# EAGLE design dwm_mk1 (EAGLE 6.5.0)
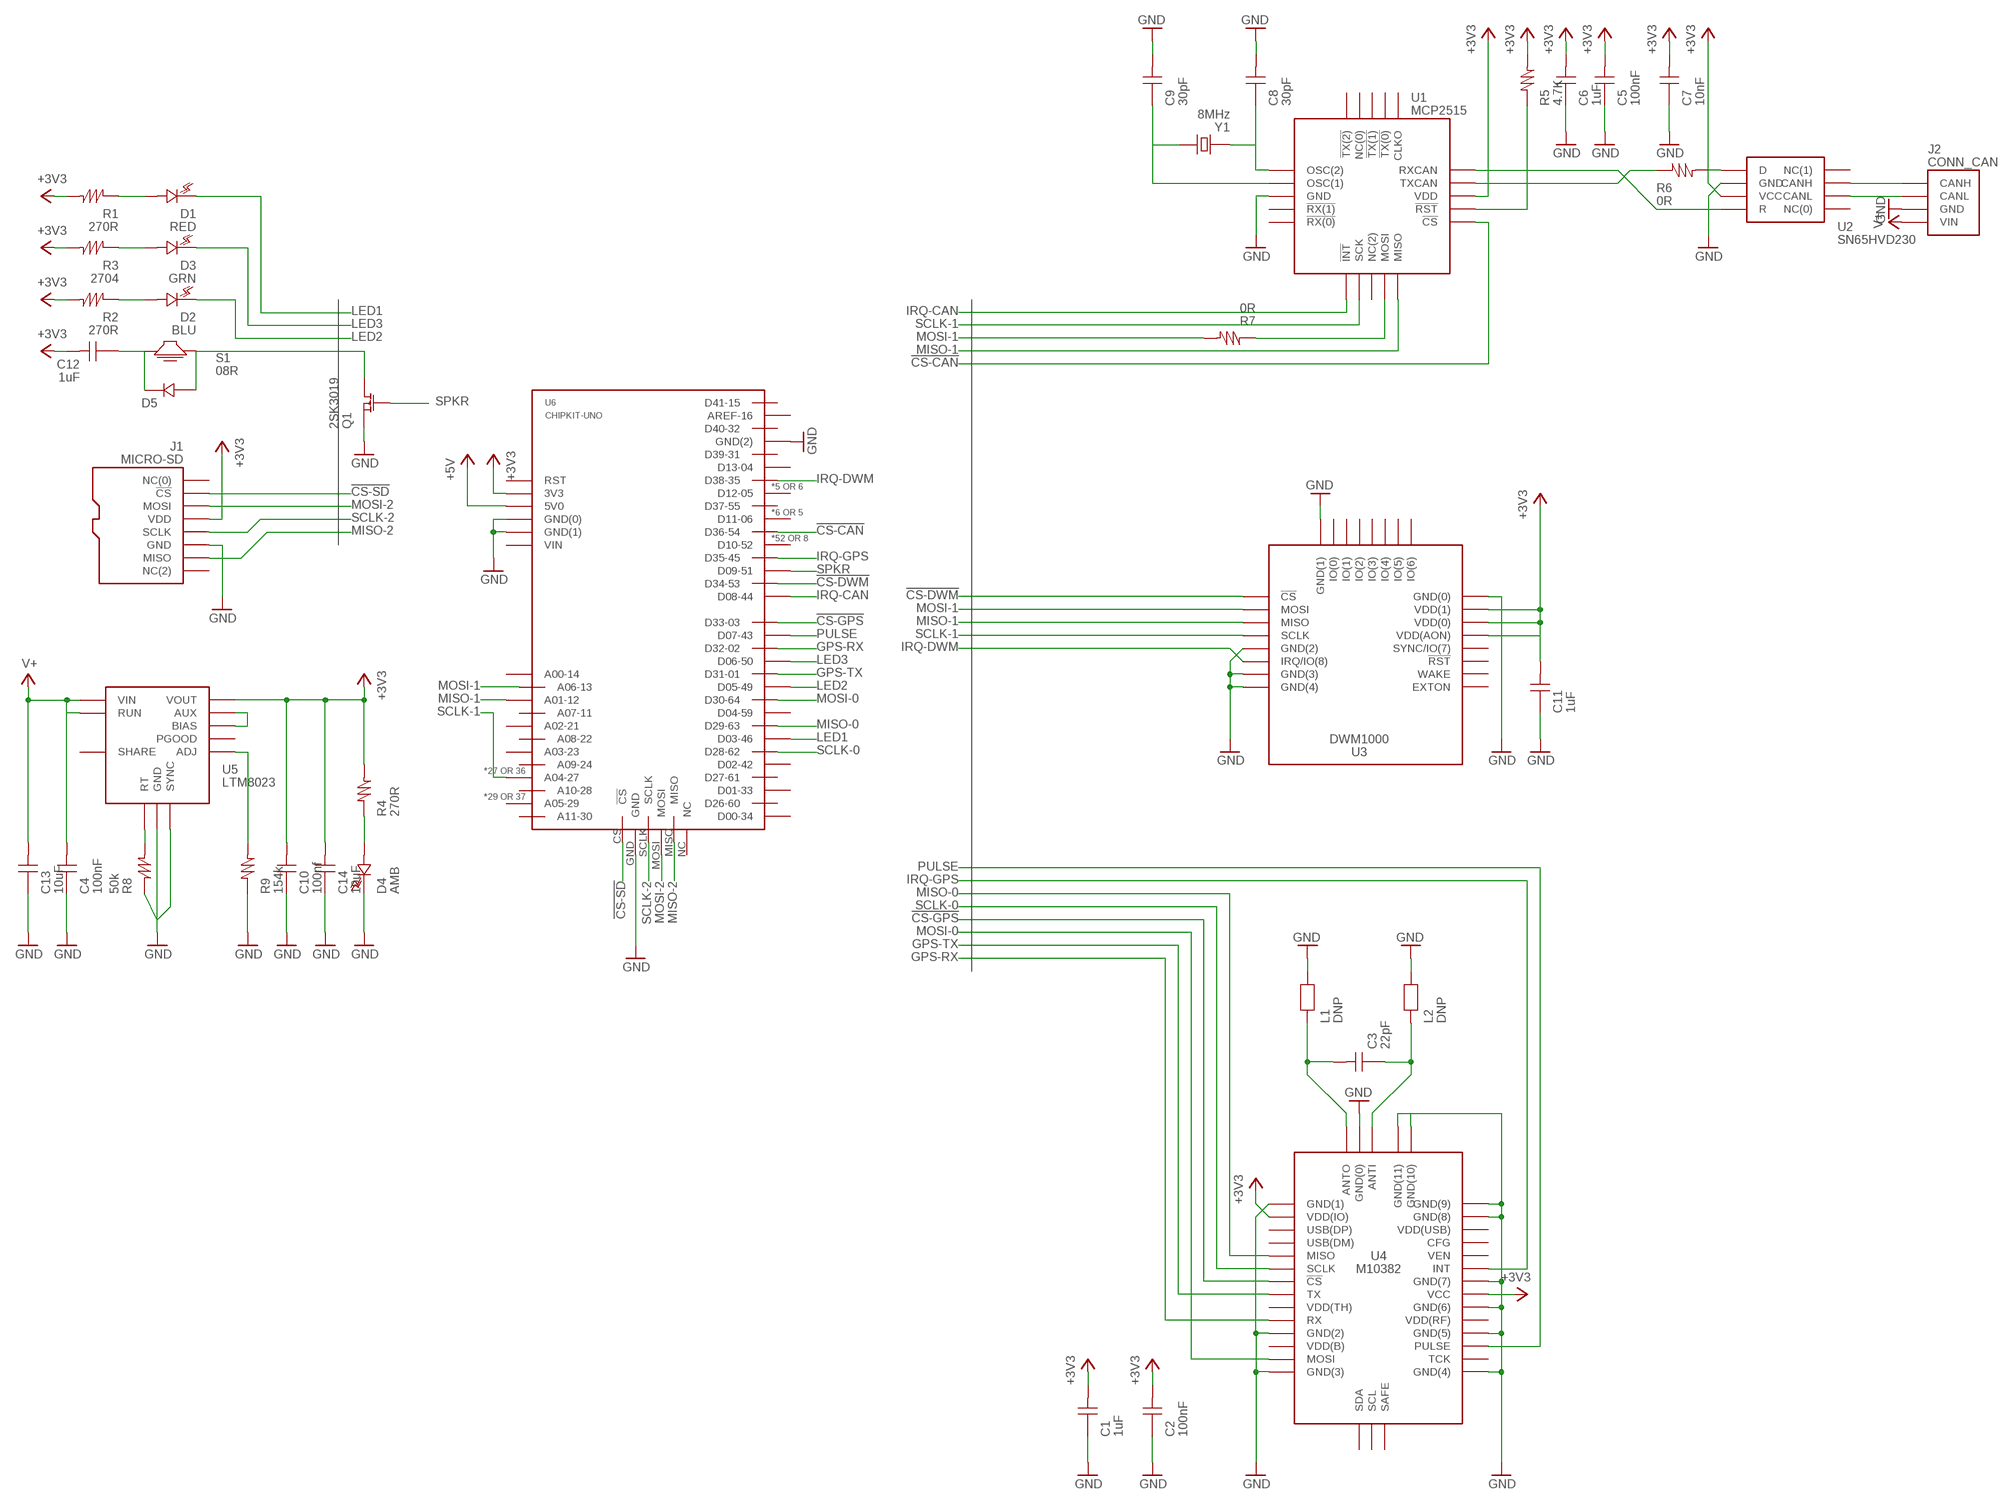
[diagram p0: schematic, sheet 1]

## Parts
C1  1uF  CAPACITOR0603  [E_0603@1]
C2  100nF  CAPACITOR0603  [E_0603@1]
C3  22pF  CAPACITOR0603  [E_0603@1]
C4  100nF  CAPACITOR0603  [E_0603@1]
C5  100nF  CAPACITOR0603  [E_0603@1]
C6  1uF  CAPACITOR0603  [E_0603@1]
C7  10nF  CAPACITOR0603  [E_0603@1]
C8  30pF  CAPACITOR0603  [E_0603@1]
C9  30pF  CAPACITOR0603  [E_0603@1]
C10  100nf  CAPACITOR0603  [E_0603@1]
C11  1uF  CAPACITOR0603  [E_0603@1]
C12  1uF  CAPACITOR0603  [E_0603@1]
C13  10uF  CAPACITOR1206  [E_1206@1]
C14  10uF  CAPACITOR1206  [E_1206@1]
D1  RED  LED0603  [E_0603@1]
D2  BLU  LED0603  [E_0603@1]
D3  GRN  LED0603  [E_0603@1]
D4  AMB  LED0603  [E_0603@1]
D5  DIODE  DIODE0603  [E_0603@1]
J1  MICRO-SD  CONN_SDMICRO  [SMT_MICROSD]
J2  CONN_CAN  [CON_4PIN]
L1  DNP  INDUCTOR0603  [E_0603@1]
L2  DNP  INDUCTOR0603  [E_0603@1]
Q1  2SK3019  [E_SOT416]
R1  270R  RESISTOR0603  [E_0603@1]
R2  270R  RESISTOR0603  [E_0603@1]
R3  2704  RESISTOR0603  [E_0603@1]
R4  270R  RESISTOR0603  [E_0603@1]
R5  4.7K  RESISTOR0603  [E_0603@1]
R6  0R  RESISTOR0603  [E_0603@1]
R7  0R  RESISTOR0603  [E_0603@1]
R8  50k  RESISTOR0603  [E_0603@1]
R9  154k  RESISTOR0603  [E_0603@1]
S1  08R  SPEAKERSMT  [SMT_BUZZER]
U1  MCP2515  MCP2515QFN20  [E_QFN20]
U2  SN65HVD230  [E_SOIC8]
U3  DWM1000  [DEC_DWM1000]
U4  M10382  [ANT_M10382]
U5  LTM8023  [LTM_8023]
U6  CHIPKIT-UNO  CHIPKITUNO  [MCP_CHIPKITUNO]
Y1  8MHz  CTS406  [CTS_CRYSTAL]

## Nets
!CS-CAN: U1.P$16(!CS) U6.D36(D36-54)
!CS-DWM: U3.P$17(!CS) U6.D34(D34-53)
!CS-GPS: U4.P$10(!CS) U6.D33(D33-03)
!CS-SD: J1.P$2(!CS) U6.CS(!CS)
+3V3: C1.P$1 C2.P$1 C5.P$1 C6.P$1 C7.P$1 C10.P$1 C11.P$1 C12.P$1 C14.P$1 J1.P$4(VDD) R1.P$1 R2.P$1 R3.P$1 R4.P$1 R5.P$1 U1.P$18(VDD) U2.P$3(VCC) U3.P$5(VDD(AON)) U3.P$6(VDD(0)) U3.P$7(VDD(1)) U4.P$5(VDD(IO)) U4.P$27(VCC) U5.A1(VOUT) U5.A2(VOUT) U5.A3(VOUT) U5.A4(VOUT) U5.B1(VOUT) U5.B2(VOUT) U5.B3(VOUT) U5.B4(VOUT) U5.C1(VOUT) U5.C2(VOUT) U5.C3(VOUT) U5.C4(VOUT) U6.3V3
+5V: U6.5V0
GND: C1.P$2 C2.P$2 C4.P$2 C5.P$2 C6.P$2 C7.P$2 C8.P$1 C9.P$1 C10.P$2 C11.P$2 C13.P$2 C14.P$2 D4.P$2 J1.P$6(GND) J2.P$3(GND) L1.P$1 L2.P$1 Q1.P$1(SOURCE) R8.P$2 R9.P$2 U1.P$8(GND) U2.P$2(GND) U3.P$8(GND(0)) U3.P$16(GND(1)) U3.P$21(GND(2)) U3.P$23(GND(3)) U3.P$24(GND(4)) U4.P$2(GND(0)) U4.P$4(GND(1)) U4.P$14(GND(2)) U4.P$17(GND(3)) U4.P$21(GND(4)) U4.P$24(GND(5)) U4.P$26(GND(6)) U4.P$28(GND(7)) U4.P$33(GND(8)) U4.P$34(GND(9)) U4.P$35(GND(10)) U4.P$36(GND(11)) U5.A5(GND) U5.A6(GND) U5.A7(GND) U5.B5(GND) U5.B6(GND) U5.B7(GND) U5.C5(GND) U5.C6(GND) U5.C7(GND) U5.D1(GND) U5.D2(GND) U5.D3(GND) U5.D4(GND) U5.D5(GND) U5.D6(GND) U5.D7(GND) U5.E1(GND) U5.E2(GND) U5.E3(GND) U5.E4(GND) U5.E5(GND) U5.E6(GND) U5.E7(GND) U5.F6(GND) U5.G6(SYNC) U6.GND U6.GND(0) U6.GND(1) U6.GND(2)
GPS-RX: U4.P$13(RX) U6.D32(D32-02)
GPS-TX: U4.P$11(TX) U6.D31(D31-01)
IRQ-CAN: U1.P$11(!INT) U6.D08(D08-44)
IRQ-DWM: U3.P$22(IRQ/IO(8)) U6.D38(D38-35)
IRQ-GPS: U4.P$29(INT) U6.D35(D35-45)
LED1: D1.P$2 U6.D03(D03-46)
LED2: D2.P$2 U6.D05(D05-49)
LED3: D3.P$2 U6.D06(D06-50)
MISO-0: U4.P$8(MISO) U6.D29(D29-63)
MISO-1: U1.P$15(MISO) U3.P$19(MISO) U6.A01(A01-12)
MISO-2: J1.P$7(MISO) U6.MISO
MOSI-0: U4.P$16(MOSI) U6.D30(D30-64)
MOSI-1: R7.P$1 U3.P$18(MOSI) U6.A06(A06-13)
MOSI-2: J1.P$3(MOSI) U6.MOSI
N$1: C3.P$1 L1.P$2 U4.P$3(ANTO)
N$2: C3.P$2 L2.P$2 U4.P$1(ANTI)
N$3: D1.P$1 R1.P$2
N$4: D3.P$1 R3.P$2
N$5: R5.P$2 U1.P$17(!RST)
N$8: C12.P$2 D5.P$2 S1.P$1
N$9: R6.P$1 U2.P$1(D)
N$10: R8.P$1 U5.G7(RT)
N$11: R6.P$2 U1.P$19(TXCAN)
N$12: U1.P$20(RXCAN) U2.P$4(R)
N$13: R7.P$2 U1.P$14(MOSI)
N$14: C8.P$2 U1.P$6(OSC(2)) Y1.P$3
N$15: C9.P$2 U1.P$7(OSC(1)) Y1.P$1
N$16: R9.P$1 U5.H7(ADJ)
N$17: U5.F5(AUX) U5.G5(BIAS)
N$18: D5.P$1 Q1.P$3(DRAIN) S1.P$4
N$19: D4.P$1 R4.P$2
N$20: J2.P$1(CANH) U2.P$7(CANH)
N$21: J2.P$2(CANL) U2.P$6(CANL)
PULSE: U4.P$23(PULSE) U6.D07(D07-43)
R2: D2.P$1 R2.P$2
SCLK-0: U4.P$9(SCLK) U6.D28(D28-62)
SCLK-1: U1.P$12(SCK) U3.P$20(SCLK) U6.A04(A04-27)
SCLK-2: J1.P$5(SCLK) U6.SCLK
SPKR: Q1.P$2(GATE) U6.D09(D09-51)
V+: C4.P$1 C13.P$1 J2.P$4(VIN) U5.G1(VIN) U5.G2(VIN) U5.G3(VIN) U5.H1(VIN) U5.H2(VIN) U5.H3(VIN) U5.H5(RUN)
Unconnected: J1.P$1(NC(0)) J1.P$8(NC(2)) U1.P$1(CLKO) U1.P$2(!TX(0)) U1.P$3(!TX(1)) U1.P$4(NC(0)) U1.P$5(!TX(2)) U1.P$9(!RX(1)) U1.P$10(!RX(0)) U1.P$13(NC(2)) U2.P$5(NC(1)) U2.P$8(NC(0)) U3.P$1(EXTON) U3.P$2(WAKE) U3.P$3(!RST) U3.P$4(SYNC/IO(7)) U3.P$9(IO(6)) U3.P$10(IO(5)) U3.P$11(IO(4)) U3.P$12(IO(3)) U3.P$13(IO(2)) U3.P$14(IO(1)) U3.P$15(IO(0)) U4.P$6(USB(DP)) U4.P$7(USB(DM)) U4.P$12(VDD(TH)) U4.P$15(VDD(B)) U4.P$18(SDA) U4.P$19(SCL) U4.P$20(SAFE) U4.P$22(TCK) U4.P$25(VDD(RF)) U4.P$30(VEN) U4.P$31(CFG) U4.P$32(VDD(USB)) U5.F7(SHARE) U5.H6(PGOOD) U6.A00(A00-14) U6.A02(A02-21) U6.A03(A03-23) U6.A05(A05-29) U6.A07(A07-11) U6.A08(A08-22) U6.A09(A09-24) U6.A10(A10-28) U6.A11(A11-30) U6.AREF(AREF-16) U6.D00(D00-34) U6.D01(D01-33) U6.D02(D02-42) U6.D04(D04-59) U6.D10(D10-52) U6.D11(D11-06) U6.D12(D12-05) U6.D13(D13-04) U6.D26(D26-60) U6.D27(D27-61) U6.D37(D37-55) U6.D39(D39-31) U6.D40(D40-32) U6.D41(D41-15) U6.NC U6.RST U6.VIN

## Library data of the parts
C1-C14 = evan:CAPACITOR
D1-D4 = evan:LED
D5 = evan:DIODE
J1 = evan:CONN_SD
J2 = evan:CONN_CAN
L1 L2 = evan:INDUCTOR
Q1 = evan:2SK3019
R1-R9 = evan:RESISTOR
S1 = evan:SPEAKER
U1 = evan:MCP2515
U2 = evan:SN65HVD230
U3 = evan:DWM1000
U4 = evan:M10382
U5 = evan:LTM8023
U6 = evan:CHIPKITUNO
Y1 = evan:CTS406

## Board
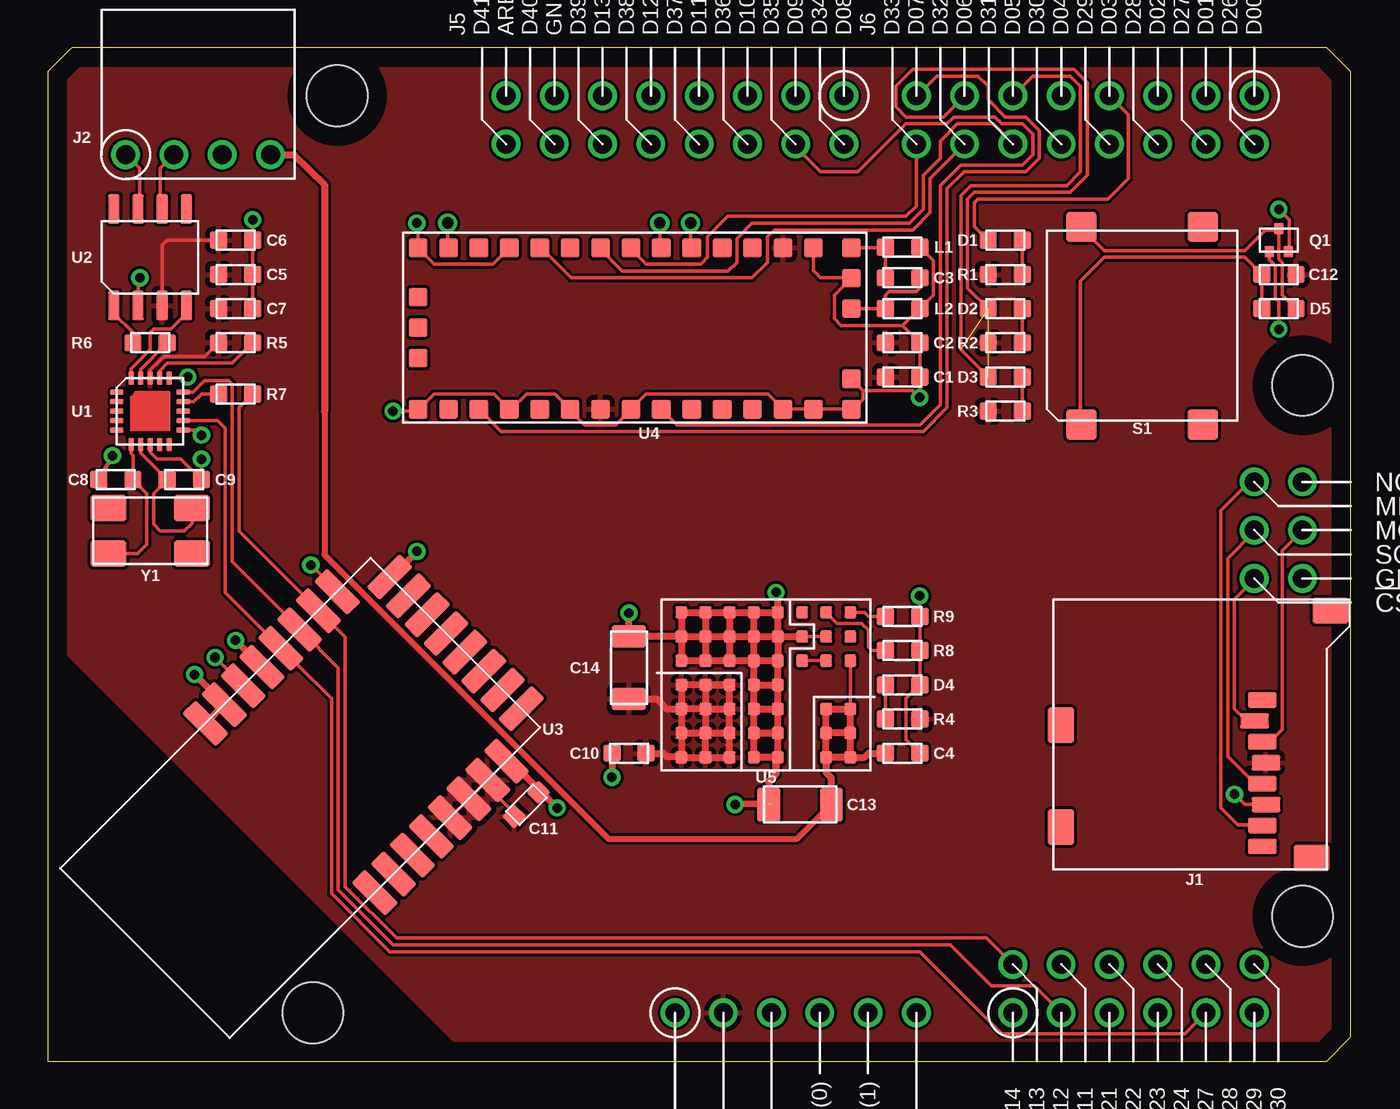
[diagram p1: board, top side]
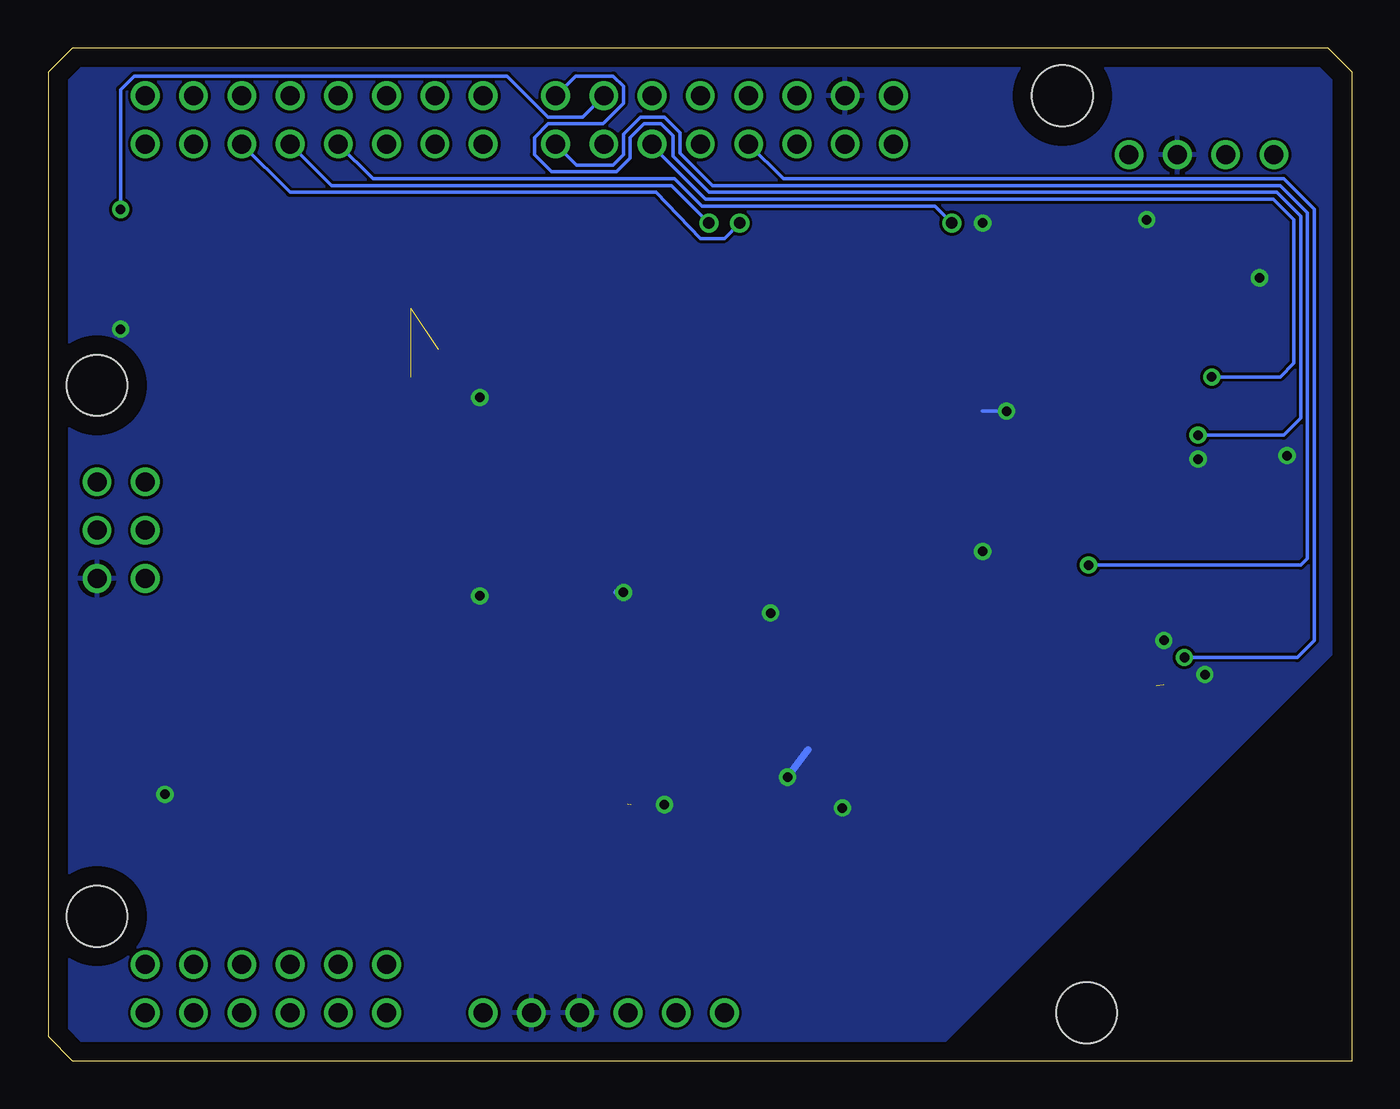
[diagram p2: board, bottom side, seen from below]

Size 68.58 x 53.34 mm. Coordinates in mm from the lower left corner, seen from the top.
Copper layers (1*16): Top 0.035mm / dielectric 1.5mm / Bottom 0.035mm
Design rules "default *": minimum track width 6mil, minimum drill 13mil, track to track 6mil, track to pad 6mil, pad to pad 6mil, via to via 6mil, smd to smd 6mil, copper to edge 40mil, drill to drill 8mil, minimum pad ring 10mil, minimum via ring 8mil, stop-mask expansion 4mil, vias tented up to drill 0mil, thermal gap 10mil

### Footprints (pad centres in the part's own frame; a part is rotated, then mirrored left to right if it is on the bottom)
E_0603 = smd 0.9 x 0.9: P$1 -0.9,0; P$2 0.9,0
E_1206 = smd 1.2 x 1.8: P$1 1.65,0; P$2 -1.65,0
SMT_MICROSD = smd 0.8 x 1.5: P$1 5.3,11; P$2 6.4,10.6; P$3 7.5,11; P$4 8.6,11.2; P$5 9.7,11; P$6 10.8,11.2; P$7 11.9,11; P$8 13,11 | smd 1.4 x 1.9: P$9 0.6,14.6; P$10 13.6,13.6 | smd 1.9 x 1.4: P$11 12,0.4; P$12 6.635,0.4
CON_4PIN = drill 1: P$1 -3.81,0; P$2 -1.27,0; P$3 1.27,0; P$4 3.81,0
E_SOT416 = smd 0.5 x 0.6: P$1 -0.5,-0.6; P$2 0.5,-0.6; P$3 0,0.6
SMT_BUZZER = smd 1.6 x 1.6: P$1 -3.2,-5.2; P$2 3.2,-5.2; P$3 3.2,5.2; P$4 -3.2,5.2
E_QFN20 = smd 0.7 x 0.28: P$1 -1.75,1; P$2 -1.75,0.5; P$3 -1.75,0; P$4 -1.75,-0.5; P$5 -1.75,-1; P$11 1.75,-1; P$12 1.75,-0.5; P$13 1.75,0; P$14 1.75,0.5; P$15 1.75,1 | smd 0.28 x 0.7: P$6 -1,-1.75; P$7 -0.5,-1.75; P$8 0,-1.75; P$9 0.5,-1.75; P$10 1,-1.75; P$16 1,1.75; P$17 0.5,1.75; P$18 0,1.75; P$19 -0.5,1.75; P$20 -1,1.75
E_SOIC8 = smd 0.6 x 1.55: P$1 -1.905,-2.54; P$2 -0.635,-2.54; P$3 0.635,-2.54; P$4 1.905,-2.54; P$5 1.905,2.54; P$6 0.635,2.54; P$7 -0.635,2.54; P$8 -1.905,2.54
DEC_DWM1000 = smd 2.5 x 1: P$1 -6.3,12.3; P$2 -6.3,10.9; P$3 -6.3,9.5; P$4 -6.3,8.1; P$5 -6.3,6.7; P$6 -6.3,5.3; P$7 -6.3,3.9; P$8 -6.3,2.5; P$17 6.3,2.5; P$18 6.3,3.9; P$19 6.3,5.3; P$20 6.3,6.7; P$21 6.3,8.1; P$22 6.3,9.5; P$23 6.3,10.9; P$24 6.3,12.3 | smd 1 x 2.5: P$9 -4.9,0; P$10 -3.5,0; P$11 -2.1,0; P$12 -0.7,0; P$13 0.7,0; P$14 2.1,0; P$15 3.5,0; P$16 4.9,0
ANT_M10382 = smd 1 x 1: P$1 0,0; P$2 0,1.6; P$3 0,3.2; P$4 -2,3.2; P$5 -3.6,3.2; P$6 -5.2,3.2; P$7 -6.8,3.2; P$8 -8.4,3.2; P$9 -10,3.2; P$10 -11.6,3.2; P$11 -13.2,3.2; P$12 -14.8,3.2; P$13 -16.4,3.2; P$14 -18,3.2; P$15 -19.6,3.2; P$16 -21.2,3.2; P$17 -22.8,3.2; P$18 -22.8,0.6; P$19 -22.8,-1; P$20 -22.8,-2.6; P$21 -22.8,-5.3; P$22 -21.2,-5.3; P$23 -19.6,-5.3; P$24 -18,-5.3; P$25 -16.4,-5.3; P$26 -14.8,-5.3; P$27 -13.2,-5.3; P$28 -11.6,-5.3; P$29 -10,-5.3; P$30 -8.4,-5.3; P$31 -6.8,-5.3; P$32 -5.2,-5.3; P$33 -3.6,-5.3; P$34 -2,-5.3; P$35 0,-5.3; P$36 0,-3.7
LTM_8023 = smd 0.635 x 0.635: A1 -4.445,-3.81; A2 -4.445,-2.54; A3 -4.445,-1.27; A4 -4.445,0; A5 -4.445,1.27; A6 -4.445,2.54; A7 -4.445,3.81; B1 -3.175,-3.81; B2 -3.175,-2.54; B3 -3.175,-1.27; B4 -3.175,0; B5 -3.175,1.27; B6 -3.175,2.54; B7 -3.175,3.81; C1 -1.905,-3.81; C2 -1.905,-2.54; C3 -1.905,-1.27; C4 -1.905,0; C5 -1.905,1.27; C6 -1.905,2.54; C7 -1.905,3.81; D1 -0.635,-3.81; D2 -0.635,-2.54; D3 -0.635,-1.27; D4 -0.635,0; D5 -0.635,1.27; D6 -0.635,2.54; D7 -0.635,3.81; E1 0.635,-3.81; E2 0.635,-2.54; E3 0.635,-1.27; E4 0.635,0; E5 0.635,1.27; E6 0.635,2.54; E7 0.635,3.81; F5 1.905,1.27; F6 1.905,2.54; F7 1.905,3.81; G1 3.175,-3.81; G2 3.175,-2.54; G3 3.175,-1.27; G5 3.175,1.27; G6 3.175,2.54; G7 3.175,3.81; H1 4.445,-3.81; H2 4.445,-2.54; H3 4.445,-1.27; H5 4.445,1.27; H6 4.445,2.54; H7 4.445,3.81
MCP_CHIPKITUNO = drill 1: 3V3 35.56,2.54; 5V0 38.1,2.54; A00 50.8,2.54; A01 53.34,2.54; A02 55.88,2.54; A03 58.42,2.54; A04 60.96,2.54; A05 63.5,2.54; A06 50.8,5.08; A07 53.34,5.08; A08 55.88,5.08; A09 58.42,5.08; A10 60.96,5.08; A11 63.5,5.08; AREF 24.13,50.8; CS 63.5,25.4; D00 63.5,50.8; D01 60.96,50.8; D02 58.42,50.8; D03 55.88,50.8; D04 53.34,50.8; D05 50.8,50.8; D06 48.26,50.8; D07 45.72,50.8; D08 41.91,50.8; D09 39.37,50.8; D10 36.83,50.8; D11 34.29,50.8; D12 31.75,50.8; D13 29.21,50.8; D26 63.5,48.26; D27 60.96,48.26; D28 58.42,48.26; D29 55.88,48.26; D30 53.34,48.26; D31 50.8,48.26; D32 48.26,48.26; D33 45.72,48.26; D34 41.91,48.26; D35 39.37,48.26; D36 36.83,48.26; D37 34.29,48.26; D38 31.75,48.26; D39 29.21,48.26; D40 26.67,48.26; D41 24.13,48.26; GND 66.04,25.4; GND(0) 40.64,2.54; GND(1) 43.18,2.54; GND(2) 26.67,50.8; MISO 63.5,30.48; MOSI 66.04,27.94; NC 66.04,30.48; RST 33.02,2.54; SCLK 63.5,27.94; VIN 45.72,2.54 | hole 3.2: 13.97,2.54; 66.04,7.62; 66.04,35.56; 15.24,50.8
CTS_CRYSTAL = smd 1.9 x 1.4: P$1 -2.2,-1.2; P$2 2.2,-1.2; P$3 2.2,1.2; P$4 -2.2,1.2

### Placement (x,y rotation side)
C1  1uF  [E_0603]  45,36 0 top
C2  100nF  [E_0603]  45,37.8 0 top
C3  22pF  [E_0603]  45,41.22 0 top
C4  100nF  [E_0603]  45,16.2 0 top
C5  100nF  [E_0603]  9.9,41.4 0 top
C6  1uF  [E_0603]  9.9,43.2 0 top
C7  10nF  [E_0603]  9.9,39.6 0 top
C8  30pF  [E_0603]  3.6,30.6 0 top
C9  30pF  [E_0603]  7.2,30.6 180 top
C10  100nf  [E_0603]  30.6,16.2 180 top
C11  1uF  [E_0603]  25.2,13.5 45 top
C12  1uF  [E_0603]  64.8,41.4 180 top
C13  10uF  [E_1206]  39.6,13.5 0 top
C14  10uF  [E_1206]  30.6,20.7 270 top
D1  RED  [E_0603]  50.4,43.2 180 top
D2  BLU  [E_0603]  50.4,39.6 180 top
D3  GRN  [E_0603]  50.4,36 180 top
D4  AMB  [E_0603]  45,19.8 0 top
D5  DIODE  [E_0603]  64.8,39.6 180 top
J1  52.92,24.3 270 top
J2  7.92,47.7 0 top
L1  DNP  [E_0603]  45,42.84 180 top
L2  DNP  [E_0603]  45,39.6 180 top
Q1  64.8,43.2 0 top
R1  270R  [E_0603]  50.4,41.4 0 top
R2  270R  [E_0603]  50.4,37.8 0 top
R3  2704  [E_0603]  50.4,34.2 0 top
R4  270R  [E_0603]  45,18 180 top
R5  4.7K  [E_0603]  9.9,37.8 0 top
R6  0R  [E_0603]  5.4,37.8 0 top
R7  0R  [E_0603]  9.9,35.1 180 top
R8  50k  [E_0603]  45,21.6 0 top
R9  154k  [E_0603]  45,23.4 0 top
S1  57.6,38.7 0 top
U1  5.4,34.2 0 top
U2  5.4,42.3 0 top
U3  21.47,22.01 135 top
U4  42.3,39.6 0 top
U5  37.8,19.8 0 top
U6  0,0 0 top
Y1  5.4,27.9 180 top

### Tracks (layer width: path | path; a pad name or v marks a point on that pad's centre or on a via)
!CS-CAN  (via drill 0.5)
  Top 0.18: v7.38,36 7.33,35.95 U1.P$16
  Bottom 0.18: U6.D36 36.83,48.17 34.02,45.36 4.14,45.36 3.06,44.28 3.06,36.72 3.78,36 v7.38,36
!CS-DWM  (via drill 0.5)
  Top 0.18: v13.86,26.1 15.26,24.7 U3.P$17
  Bottom 0.18: U6.D34 40.81,47.16 38.88,47.16 38.34,47.7 38.34,48.78 37.44,49.68 36.18,49.68 35.37,48.87 35.37,47.79 33.66,46.08 3.78,46.08 2.34,44.64 2.34,26.46 2.7,26.1 v13.86,26.1
!CS-GPS
  Top 0.18: U4.P$10 30.7,42.74 31.5,41.94 34.38,41.94 34.74,42.3 34.74,43.38 35.82,44.46 45.18,44.46 45.72,45 U6.D33
!CS-SD
  Top 0.18: U6.CS 63.5,25.34 62.46,24.3 62.46,18.54 63,18 63.42,18 J1.P$2
+3V3
  Top 0.18: U1.P$18 5.4,36.36 6.12,37.08 8.28,37.08 R5.P$1 | U4.P$27 29.06,34.3 | C11.P$1 24.58,13.04 23.16,14.46 U3.P$7 U3.P$6 U3.P$5 | U2.P$3 6.04,42.94 6.3,43.2 C6.P$1
  Top 0.36: U5.C4 U5.B4 U5.B3 | U5.B3 U5.C3 | U5.A2 U5.B2 | U5.B2 U5.C2 | U5.A1 U5.B1 | U5.B1 U5.C1 | U5.C1 U5.C3 | U5.B3 U5.B2 | U5.B1 U5.B2 | U5.C1 35.9,17 36,17.1 | U5.C3 U5.C4 | U5.B3 U5.A3 | U5.A4 U5.A3 | U5.A3 U5.A1 | U5.C4 33.3,19.8 | C14.P$1 32.07,19.05 32.58,18.54 U5.A3 | C10.P$1 32.4,16.2 32.58,16.02 33.33,16.02 U5.A1
  pour Top: -0.9,23.4 23.4,-0.9 69.3,-0.9 69.3,54 -0.9,54
GND  (via drill 0.5)  (1 unrouted)
  Top 0.18: L1.P$1 46.62,42.12 46.62,40.32 L2.P$1 45,38.7 | C7.P$2 C5.P$2 C6.P$2 v10.8,44.28 | U1.P$8 5.4,32.04 5.76,31.68 7.02,31.68 C9.P$1 v8.1,31.68 | C8.P$1 v3.42,31.86 | v19.44,44.1 19.5,44.04 U4.P$17 19.5,42.78 20.34,41.94 23.44,41.94 U4.P$14 | v18.18,34.2 18.9,34.2 U4.P$21 19.54,34.3 20.34,35.1 23.5,35.1 U4.P$24 24.4,34.3 25.2,35.1 26.7,35.1 U4.P$26 27.5,34.24 28.26,33.48 29.88,33.48 U4.P$28 31.5,35.1 37.9,35.1 U4.P$33 U4.P$34 U4.P$35 42.4,34.3 42.92,34.82 42.92,35.28 | 42.92,35.28 U4.P$36 | 42.92,35.28 45.54,35.28 v45.9,34.92 C1.P$2 C2.P$2 45,38.7 | U3.P$8 24.55,15.79 C11.P$2 | J1.P$6 63,13.5 v62.46,14.04 | U5.G6 U5.F6 | U2.P$2 4.76,40.95 v4.86,41.22 | C4.P$2 45.18,16.92 45.18,19.08 D4.P$2 R8.P$2 R9.P$2 v45.9,24.48 | 38.34,15.12 38.44,15.21 U5.E1 | Q1.P$1 64.3,42.17 64.62,41.85 64.62,40.14 64.8,39.96 v64.8,38.52 | U4.P$4 40.3,41.6 40.68,41.22 42.28,41.22 U4.P$2 42.28,41.2 41.4,40.32 41.4,39.06 41.76,38.7 45,38.7
  Top 0.36: U5.B7 U5.A7 U5.A6 | U5.B7 U5.C7 | U5.C7 U5.D7 | U5.D7 U5.E7 | U5.A6 U5.B6 | U5.B6 U5.C6 | U5.D6 U5.E6 | U5.E6 U5.F6 | U5.B5 U5.A5 U5.A6 | U5.B5 U5.C5 | U5.C5 U5.D5 | U5.E2 U5.E1 37.29,15.99 37.26,16.02 | U5.E2 U5.E3 | U5.E3 U5.E4 | U5.E4 U5.E5 | U5.E6 U5.E7 | U5.D1 U5.D2 | U5.D2 U5.D3 | U5.D3 U5.D4 | U5.D4 U5.D5 | U5.D5 U5.D6 | U5.D6 U5.D7 | U5.D4 U5.E4 | U5.D3 U5.E3 | U5.D2 U5.E2 | U5.B7 U5.B6 | U5.B6 U5.B5 | U5.C6 U5.C5 | U5.C7 U5.C6 | U5.E6 U5.E5 | U5.D5 U5.E5 | U5.C6 U5.D6 | C14.P$2 30.6,22.86 | 38.34,15.84 38.34,15.12 37.95,14.73 38.13,13.53 v36.18,13.5 | U5.E7 38.44,24.57 v38.34,24.66 | U5.A6 31.12,22.34 30.6,22.86 | 30.6,22.86 v30.6,23.58 | C10.P$2 v29.7,14.94 | U3.P$16 18.09,25.47 v19.44,26.82 | U3.P$21 11.29,20.75 v9.9,22.14 | v7.74,20.34 9.3,18.77 U3.P$23 U3.P$24 | 24.55,15.79 24.55,15.59 v26.82,13.32
  Bottom 0.18: v3.42,31.86 3.42,32.04 | v8.1,31.68 8.1,31.86 | v19.44,44.1 19.44,44.28 | v18.18,34.2 19.44,34.2 | v45.9,34.92 45.9,34.74 | v62.46,14.04 62.46,14.22 | v4.86,41.22 4.68,41.22 | v64.8,38.52 64.8,38.34 | v10.8,44.28 10.98,44.46 | v45.9,24.48 45.9,24.66
  Bottom 0.36: v36.18,13.5 36.36,13.5 | v38.34,24.66 38.7,24.66 | v30.6,23.58 30.6,23.76 | v29.7,14.94 28.62,16.38 | v19.44,26.82 19.44,27 | v9.9,22.14 9.9,22.32 | v7.74,20.34 7.74,20.52 | v26.82,13.32 27,13.5
  pour Bottom: 0,22.5 22.5,0 68.4,0 68.4,53.1 0,53.1
GPS-RX
  Top 0.18: U4.P$13 25.96,42.8 27.54,41.22 37.08,41.22 37.89,42.03 37.89,43.38 38.25,43.74 45.54,43.74 46.44,44.64 46.44,46.44 U6.D32
GPS-TX
  Top 0.18: U4.P$11 29.1,42.72 30.24,41.58 35.82,41.58 36.27,42.03 36.27,43.29 37.08,44.1 45.36,44.1 46.08,44.82 46.08,46.62 46.98,47.52 46.98,48.42 47.88,49.32 49.74,49.32 U6.D31
IRQ-CAN  (via drill 0.5)
  Top 0.18: v8.1,32.94 7.84,33.2 U1.P$11
  Bottom 0.18: U6.D08 40.87,51.84 38.88,51.84 38.34,51.3 38.34,50.4 39.42,49.32 42.3,49.32 43.02,48.6 43.02,47.7 42.12,46.8 38.7,46.8 37.98,47.52 37.98,48.6 37.26,49.32 36.36,49.32 35.73,48.69 35.73,47.61 33.84,45.72 3.96,45.72 2.7,44.46 2.7,33.84 3.6,32.94 v8.1,32.94
IRQ-DWM  (via drill 0.5)  (1 unrouted)
  Top 0.18: 9.9,19.8 9.9,20.16 v8.82,21.24
  Bottom 0.18: U6.D38 29.93,46.44 3.6,46.44 1.98,44.82 1.98,22.14 2.88,21.24 v8.82,21.24
IRQ-GPS
  Top 0.18: U6.D35 39.37,48.11 40.68,46.8 42.66,46.8 45.18,49.32 47.34,49.32 47.7,49.68 49.86,49.68 50.22,49.32 51.3,49.32 51.84,48.78 51.84,47.7 51.3,47.16 48.06,47.16 46.98,46.08 46.98,34.56 45.9,33.48 33.12,33.48 U4.P$29
LED1
  Top 0.18: D1.P$2 48.78,43.92 48.78,45.18 48.96,45.36 55.8,45.36 56.88,46.44 56.88,49.8 U6.D03
LED2  (1 unrouted)
  Top 0.18: U6.D05 51.84,51.84 53.82,51.84 54.36,51.3 54.36,46.8 53.64,46.08 48.6,46.08 48.06,45.54 48.06,37.44 49.5,36
LED3  (1 unrouted)
  Top 0.18: U6.D06 47.14,49.68 45.18,49.68 44.64,50.22 44.64,51.3 45.54,52.2 54,52.2 54.72,51.48 54.72,46.62 53.82,45.72 48.78,45.72 48.42,45.36 48.42,40.68 49.5,39.6
MISO-0  (via drill 0.6)
  Top 0.18: U4.P$8 33.84,42.86 v33.84,44.1
  Bottom 0.18: 34.2,44.1 v33.84,44.1 35.82,46.08 53.7,46.08 U6.D29
MISO-1
  Top 0.18: U1.P$15 7.66,35.2 8.28,35.82 9.54,35.82 9.72,35.64 9.72,26.28 13.27,22.73 U3.P$19 13.28,22.72 15.3,20.7 15.3,9 18.18,6.12 47.52,6.12 49.68,3.96 51.92,3.96 U6.A01
MISO-2
  Top 0.18: U6.MISO 63.24,30.48 61.74,28.98 61.74,13.32 62.64,12.42 63.54,12.42 J1.P$7
MOSI-0  (via drill 0.6)
  Top 0.18: U4.P$16 21.06,42.84 v21.06,44.1
  Bottom 0.18: v21.06,44.1 21.96,45 34.2,45 35.64,46.44 51.52,46.44 U6.D30
MOSI-1
  Top 0.18: R7.P$1 10.08,34.38 10.08,27.9 14.26,23.73 U3.P$18 14.27,23.71 15.66,22.32 15.66,9.18 18.36,6.48 49.4,6.48 U6.A06
MOSI-2
  Top 0.18: J1.P$3 64.32,16.8 64.98,17.46 64.98,26.88 U6.MOSI
N$1
  Top 0.18: U4.P$3 44.1,42.8 L1.P$2 C3.P$1
N$2
  Top 0.18: U4.P$1 L2.P$2 44.1,40.32 44.28,40.5 45.72,40.5 45.9,40.68 C3.P$2
N$3
  Top 0.18: D1.P$1 R1.P$2
N$4
  Top 0.18: D3.P$1 R3.P$2
N$5
  Top 0.18: U1.P$17 5.9,36.32 6.3,36.72 9.72,36.72 R5.P$2
N$8
  Top 0.18: S1.P$1 54.22,33.52 54.36,33.66 54.36,41.04 55.62,42.3 63,42.3 C12.P$2 D5.P$2
N$9
  Top 0.18: R6.P$1 4.5,38.34 3.5,39.34 U2.P$1
N$10
  Top 0.18: R8.P$1 43.38,21.6 43.2,21.78 43.2,22.68 42.84,23.04 41.55,23.04 U5.G7
N$11
  Top 0.18: U1.P$19 4.9,36.4 R6.P$2
N$12
  Top 0.18: U1.P$20 4.4,36.44 5.4,37.44 5.4,38.34 5.58,38.52 6.48,38.52 7.2,39.24 7.2,39.6 | 7.2,39.6 7.2,39.66 | U2.P$4 7.3,39.7 7.2,39.6
N$13
  Top 0.18: U1.P$14 7.7,34.7 8.1,35.1 R7.P$2
N$14
  Top 0.18: U1.P$6 4.4,31.96 4.5,31.86 C8.P$2 5.22,29.88 5.22,27.18 4.74,26.7 Y1.P$3
N$15
  Top 0.18: U1.P$7 4.9,32 C9.P$2 5.58,29.88 5.58,28.26 5.94,27.9 7.2,27.9 7.6,28.3 Y1.P$1
N$16
  Top 0.18: R9.P$1 43.2,23.4 42.99,23.61 U5.H7
N$17
  Top 0.18: U5.F5 U5.G5
N$18
  Top 0.18: S1.P$4 54.4,43.88 55.62,42.66 63,42.66 64.08,43.74 64.74,43.74 Q1.P$3 64.8,42.21 64.98,42.03 64.98,40.32 D5.P$1
N$19
  Top 0.18: R4.P$2 D4.P$1
N$20
  Top 0.18: J2.P$1 4.14,47.7 4.86,46.98 4.86,44.94 U2.P$7
N$21
  Top 0.18: J2.P$2 5.94,46.98 5.94,44.94 U2.P$6
PULSE
  Top 0.18: U6.D07 45.76,50.8 46.8,51.84 48.96,51.84 49.5,51.3 49.5,50.58 50.4,49.68 51.48,49.68 52.2,48.96 52.2,47.52 51.48,46.8 48.24,46.8 47.34,45.9 47.34,34.38 46.08,33.12 23.88,33.12 U4.P$23
R2
  Top 0.18: D2.P$1 R2.P$2
SCLK-0  (via drill 0.6)
  Top 0.18: U4.P$9 32.22,42.88 v32.22,44.1
  Bottom 0.18: 32.22,44.28 v32.22,44.1 33.03,43.29 34.29,43.29 36.63,45.72 55.88,45.72 U6.D28
SCLK-1
  Top 0.18: U1.P$12 8.96,33.7 9.36,33.3 9.36,24.66 12.28,21.75 U3.P$20 12.28,21.39 12.78,20.88 13.14,20.88 14.94,19.08 14.94,8.82 18,5.76 45.9,5.76 50.22,1.44 59.86,1.44 U6.A04
SCLK-2
  Top 0.18: U6.SCLK 63.5,27.86 62.1,26.46 62.1,16.02 63.36,14.76 63.76,14.76 J1.P$5
SPKR  (via drill 0.5)
  Top 0.18: v64.8,44.82 65.34,44.28 65.34,42.64 Q1.P$2
  Bottom 0.18: U6.D09 40.5,49.68 42.3,49.68 44.46,51.84 64.08,51.84 64.8,51.12 64.8,45 64.98,44.82 v64.8,44.82
V+
  Top 0.18: U5.H5 42.24,18
  Top 0.305: 14.58,34.2 14.58,26.64 29.52,11.7 39.45,11.7 C13.P$1
  Top 0.36: U5.H1 U5.G1 | U5.H2 U5.G2 | U5.H1 42.24,18 U5.H3 U5.G3 U5.G2 | U5.G1 U5.G2 | U5.G2 40.98,18.48 41.04,18.54 | U5.G1 40.98,15.19 41.22,14.94 41.22,13.53 C13.P$1 | U5.H1 42.99,15.99 43.2,16.2 C4.P$1 | J2.P$4 12.96,47.7 14.58,46.11 14.58,34.2